# EasyEDA Pro project GritMaker.eprj

# Schematic GritMaker-circuit
Create Date: 2023-11-29; Page Name: P1; Project Name: GritMaker; Schematic Name: GritMaker-circuit; Update Date: 2023-12-03; Company: GritMaker; Drawed: Enkhbold Ganbold; Page Size: A4; Part Number: ESP32; Reviewed: Inky; Version: V0.1
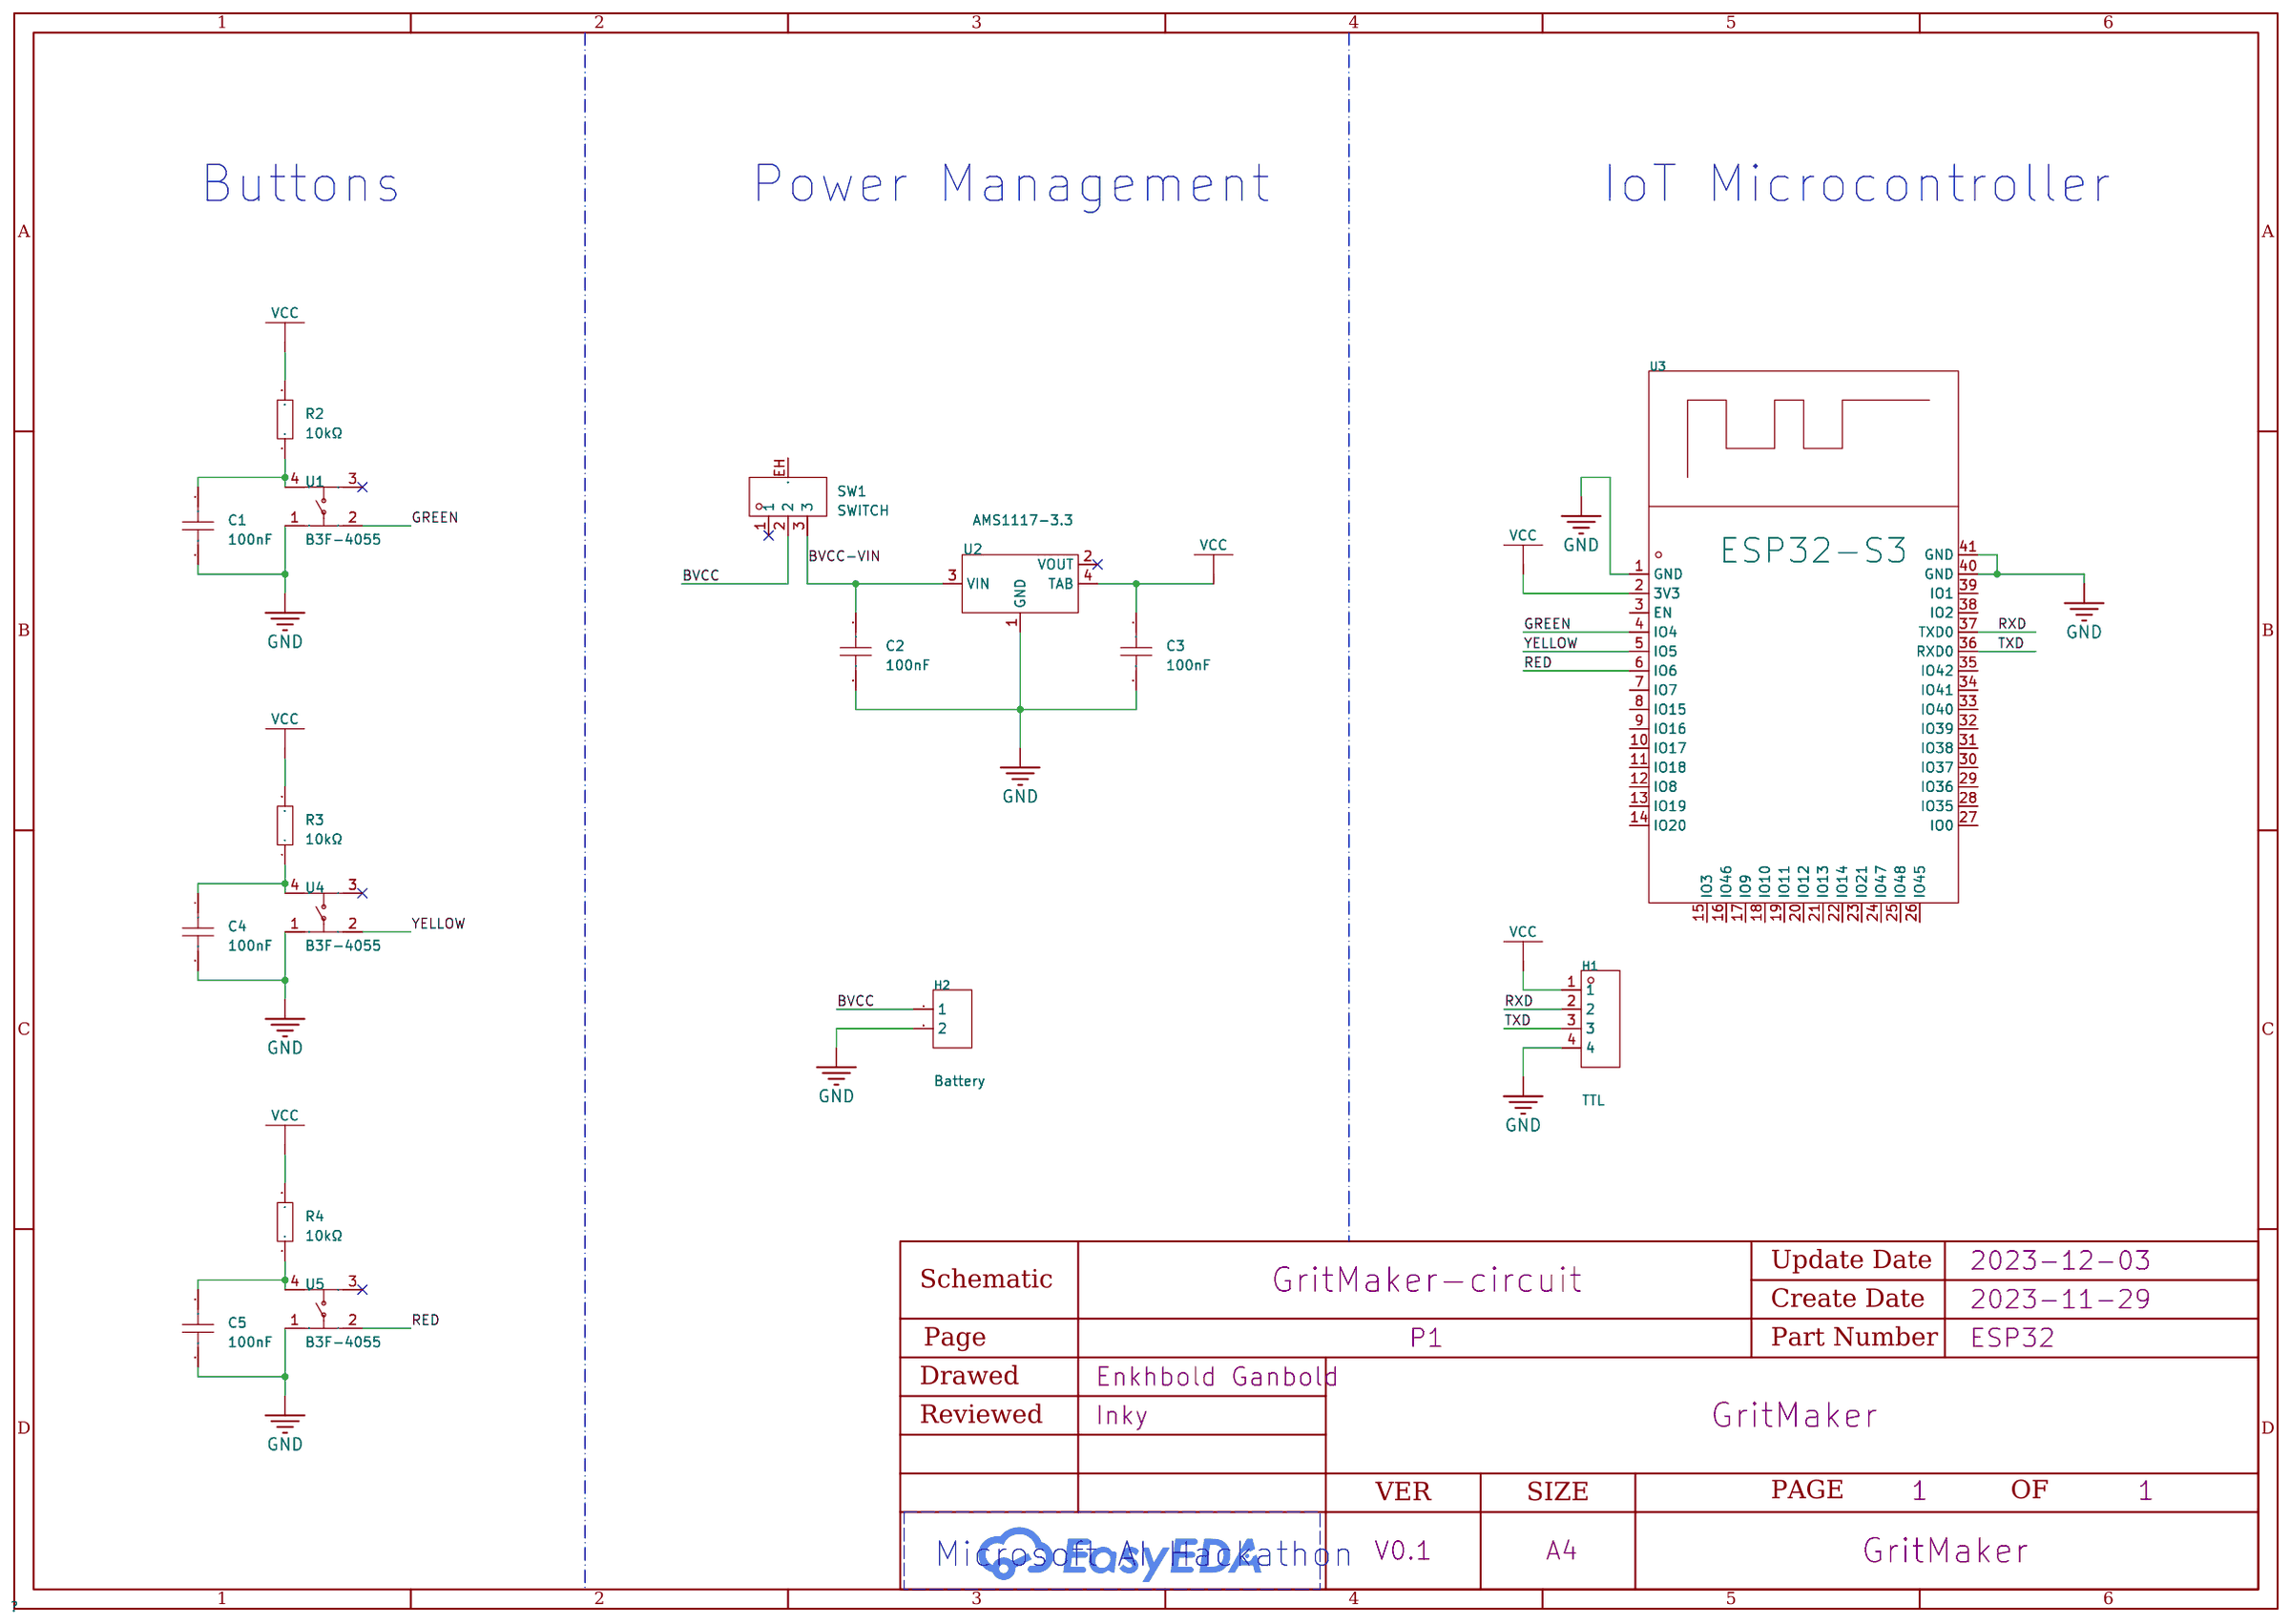
[diagram p0: schematic sheet]

## Parts
C1  100nF  [CAP-TH_L5.8-W3.6-P5.0-D0.6]
C2  100nF  [CAP-TH_L5.8-W3.6-P5.0-D0.6]
C3  100nF  [CAP-TH_L5.8-W3.6-P5.0-D0.6]
C4  100nF  [CAP-TH_L5.8-W3.6-P5.0-D0.6]
C5  100nF  [CAP-TH_L5.8-W3.6-P5.0-D0.6]
H1  TTL  [HDR-TH_4P-P2.54-V-M]
H2  Battery  [HDR-TH_2P-P2.54-V-F]
R2  10kΩ  [R_AXIAL-0.4]
R3  10kΩ  [R_AXIAL-0.4]
R4  10kΩ  [R_AXIAL-0.4]
SW1  SWITCH  [SW-TH_C9900003112]
U1  B3F-4055  [KEY-TH_4P-L12.0-W12.0-P5.00-LS13.4-EH]
U2  AMS1117-3.3  [SOT-223-3_L6.7-W3.7-P2.30-LS7.0-BR]
U3  ESP32-S3  [WIRELM-SMD_ESP32-S3-WROOM-1]
U4  B3F-4055  [KEY-TH_4P-L12.0-W12.0-P5.00-LS13.4-EH]
U5  B3F-4055  [KEY-TH_4P-L12.0-W12.0-P5.00-LS13.4-EH]

## Library data of the parts
C1-C5 = 178MU0002: Capacitance: Tolerance:±10% Tolerance:±10% Voltage Rated: Temperature Coefficient:; LCSC Part Name: 100nF ±10% 50V; Supplier Part: C5632426; Manufacturer: KNSCHA(科尼盛); Supplier Footprint: 插件,P=5.08mm; JLCPCB Part Class: Extended Part; Datasheet: https://atta.szlcsc.com/upload/public/pdf/source/20230506/08E784E6BF236BA57EBA91152AC3AC6D.pdf; Supplier: LCSC; Tolerance: ±10%
H1 = HDR-M_2.54_1x4P: Supplier Footprint: Through
H2 = HDR-F_2.54_1x2P: Supplier Footprint: Through
R2-R4 = Res_AXIAL-1/4W: Supplier Footprint: Through
SW1 = SWITCH-拨动-三脚两档: Supplier Part: C9900003112; Supplier Footprint: 插件; JLCPCB Part Class: Extended Part; Datasheet: https://atta.szlcsc.comnull; Supplier: LCSC
U1 U4 U5 = B3F-4055_C84931: Contact Current:50mA Voltage Rating (DC):24V Circuit:SPST Mounting Style:Straight Actuator Style:Square Plunger With Lamp:- Mechanical Life:- Switch Length:12mm Switch Width:12mm Switch Height:7.3mm; LCSC Part Name: 12*12*7.3mm 直插 轻触开关; Supplier Part: C84931; Manufacturer: OMRON(欧姆龙); Supplier Footprint: 插件; JLCPCB Part Class: Extended Part; Datasheet: https://atta.szlcsc.comnull; Supplier: LCSC; Contact Current: 50mA; Voltage Rating (DC): 24V; Circuit: SPST; Mounting Style: Straight; Actuator Style: Square Plunger; Switch Length: 12mm; Switch Width: 12mm; Switch Height: 7.3mm
U2 = AMS1117-3.3_C917183: Output Type:-; LCSC Part Name: 正 Vin=15V Vout=3.3V 1A; Supplier Part: C917183; Manufacturer: JSMSEMI(杰盛微); Supplier Footprint: SOT-223-3; JLCPCB Part Class: Extended Part; Datasheet: https://atta.szlcsc.com/upload/public/pdf/source/20230807/E524BD9515A5B4B5F7AFDA5AFDCDAA11.pdf; Supplier: LCSC
U3 = ESP32-S3-WROOM-1-N16: LCSC Part Name: 通用型Wi-Fi+低功耗蓝牙MCU模组; Supplier Part: C2913199; Manufacturer: ESPRESSIF(乐鑫); Supplier Footprint: SMD,18x25.5mm; JLCPCB Part Class: ExtendedPart; Datasheet: https://atta.szlcsc.com/upload/public/pdf/source/20220628/A2AC12B3C87735CAEB7EBE2DBE80936C.pdf; Supplier: LCSC

## Nets
GND: C1.2 C2.2 C3.2 C4.2 C5.2 H1.4 H2.2 U1.1 U2.1(GND) U3.1(GND) U3.40(GND) U3.41(GND) U4.1 U5.1
VCC: C3.1 H1.1 R2.2 R3.2 R4.2 U2.4(TAB) U3.2(3V3)
BVCC: H2.1 SW1.2
BVCC-VIN: C2.1 SW1.3 U2.3(VIN)
GREEN: U1.2 U3.4(IO4)
RED: U3.6(IO6) U5.2
RXD: H1.2 U3.37(TXD0)
TXD: H1.3 U3.36(RXD0)
YELLOW: U3.5(IO5) U4.2
$1N233: C1.1 R2.1 U1.4
$1N1894: C4.1 R3.1 U4.4
$1N2015: C5.1 R4.1 U5.4

Not connected (* = marked no-connect by the designer): SW1 1* EH; U1 3*; U2 2(VOUT)*; U3 3(EN) 7(IO7) 8(IO15) 9(IO16) 10(IO17) 11(IO18) 12(IO8) 13(IO19) 14(IO20) 15(IO3) 16(IO46) 17(IO9) 18(IO10) 19(IO11) 20(IO12) 21(IO13) 22(IO14) 23(IO21) 24(IO47) 25(IO48) 26(IO45) 27(IO0) 28(IO35) 29(IO36) 30(IO37) 31(IO38) 32(IO39) 33(IO40) 34(IO41) 35(IO42) 38(IO2) 39(IO1); U4 3*; U5 3*

## Notes on the sheet
- Buttons
- Power Management
- IoT Microcontroller
- Microsoft AI Hackathon

# Board GritMaker-PCB
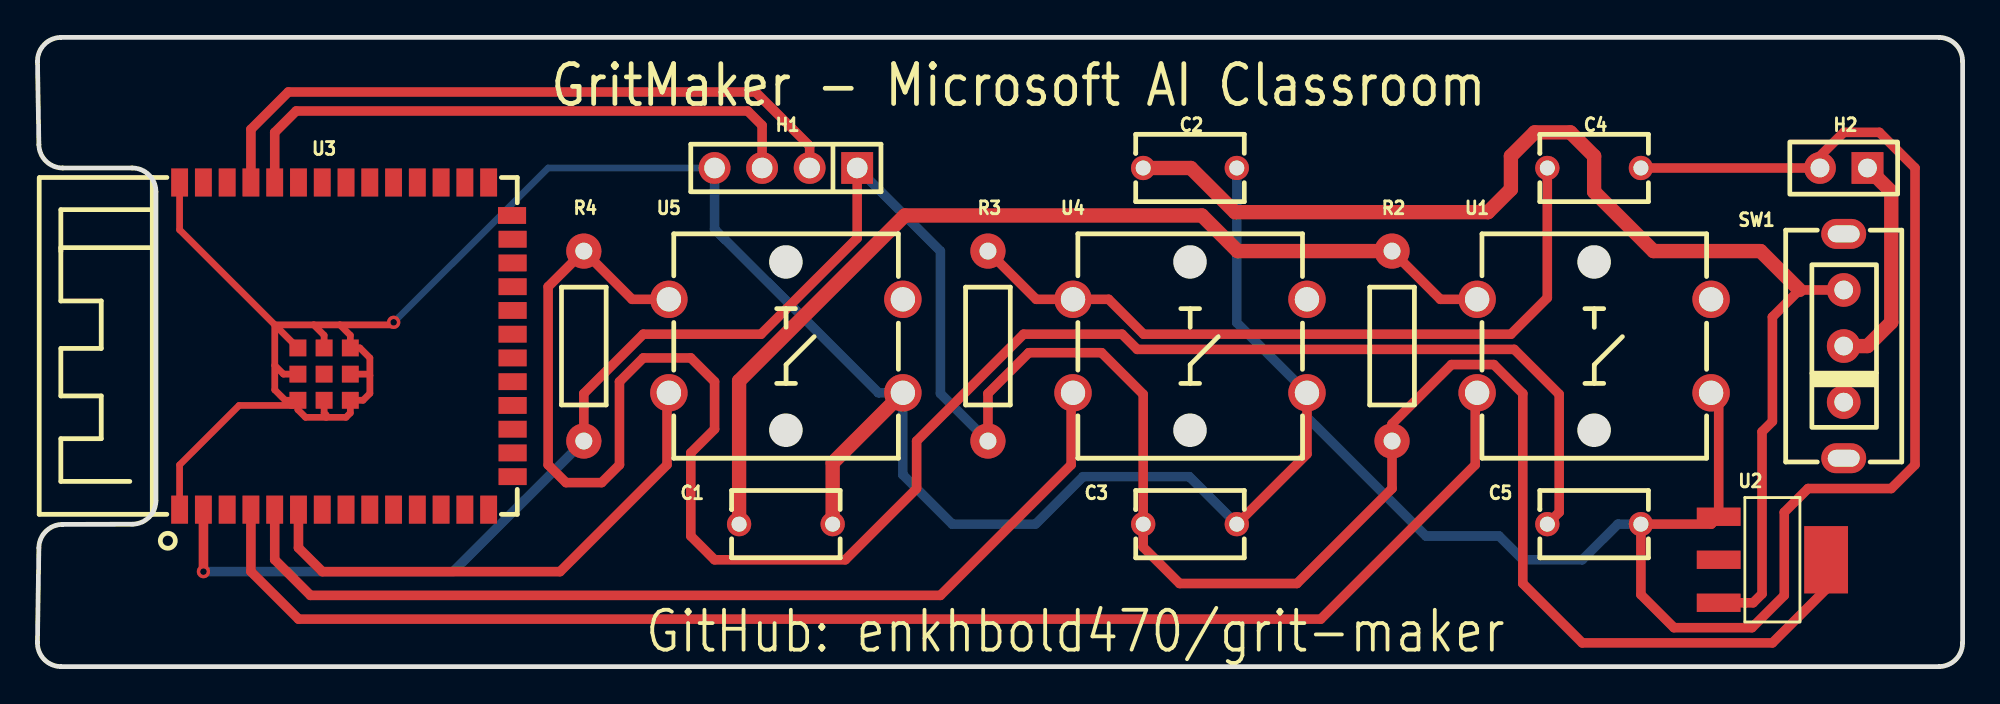
[diagram p1: board, top side]
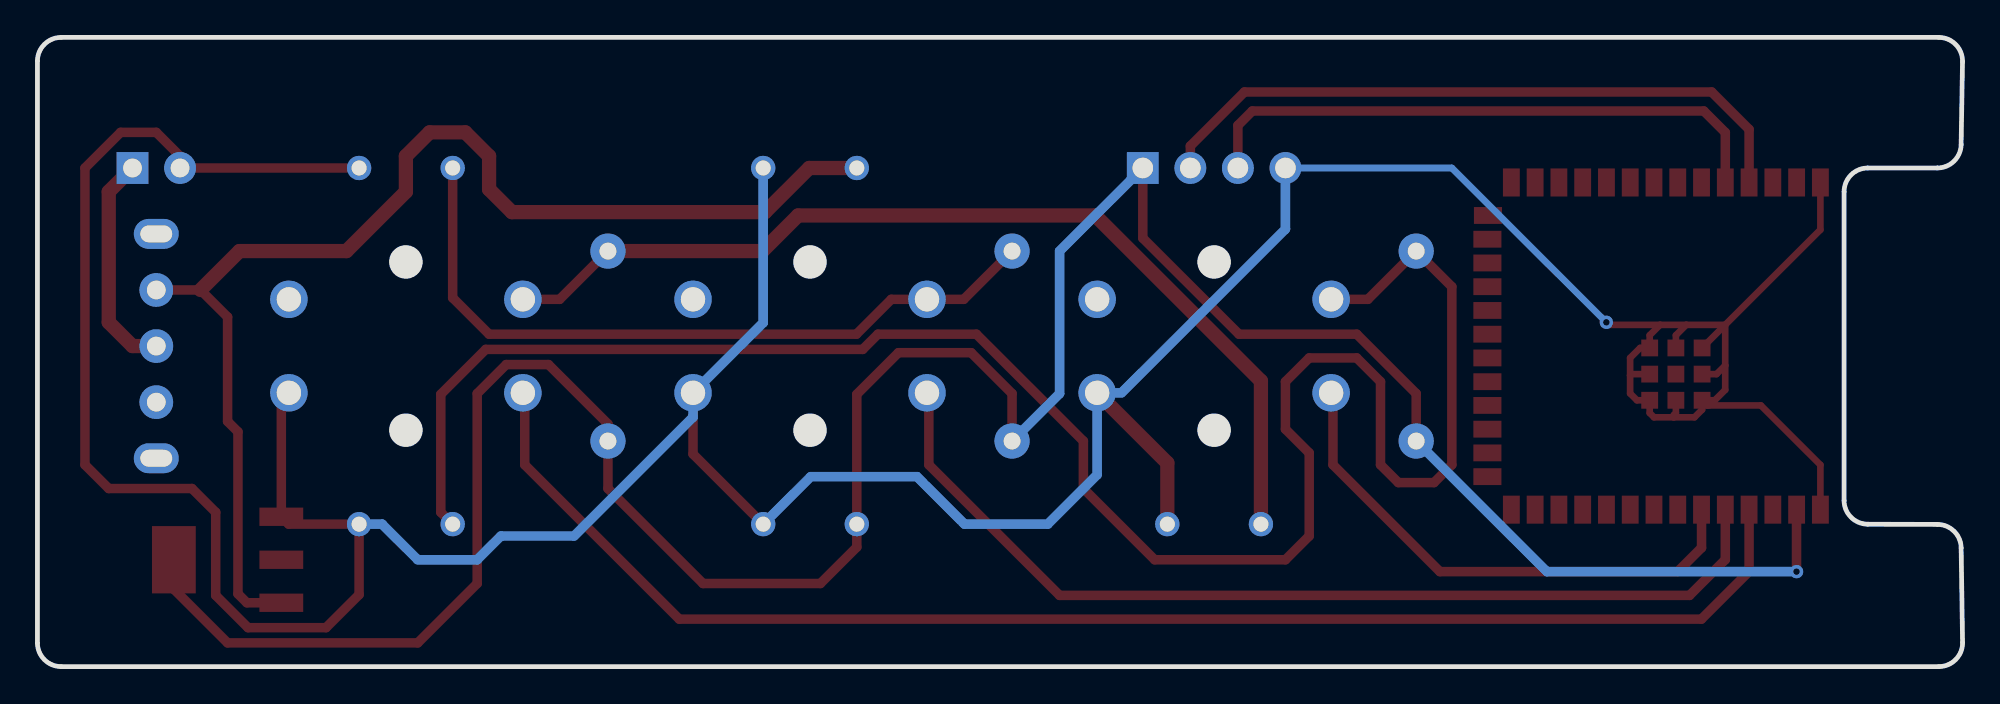
[diagram p2: board, bottom side, seen from below]

Outline 102.85 x 33.66 mm; copper layers: Top Layer, Bottom Layer. Coordinates in mm from the lower left corner of the outline.
Outline path: 0,32.36 0.08,27.92 arc(0.46,27.03) 1.35,26.67 5.06,26.67 arc(5.96,26.3) 6.33,25.4 6.33,8.89 arc(5.96,7.99) 5.06,7.62 1.34,7.61 arc(0.45,7.24) 0.08,6.36 0,1.29 arc(0.37,0.38) 1.27,0 101.58,0 arc(102.48,0.37) 102.85,1.27 102.85,32.38 arc(102.48,33.28) 101.58,33.66 1.27,33.66 arc(0.37,33.28) 0,32.36
Stack: Top Layer 0.035mm / Dielectric1 1.51mm FR4 er 4.5 / Bottom Layer 0.035mm

## Design rules (mm)
template: 8mil
spacing copperThickness1oz (default): track to track 0.305, other pairs 0.203 to 0.3
spacing copperThickness2oz: track to track 0.203, other pairs 0.152 to 0.3
track width copperThickness1oz (default): min 0.127, default 0.254, max 2.54
track width copperThickness2oz: min 0.203, default 0.254, max 2.54
differential pair differentialPair (default): width min 0.127, default 0.254, max 2.54; gap min 0.152, default 0.152
via viaSize (default): diameter min 0.5, default 0.61, max 10; hole min 0.3, default 0.305, max 6.299

## Placement (name value [footprint] x y rotation side)
C1  100nF  [CAP-TH_L5.8-W3.6-P5.0-D0.6]  39.99 7.62 0 top
C2  100nF  [CAP-TH_L5.8-W3.6-P5.0-D0.6]  61.58 26.67 0 top
C3  100nF  [CAP-TH_L5.8-W3.6-P5.0-D0.6]  61.58 7.62 0 top
C4  100nF  [CAP-TH_L5.8-W3.6-P5.0-D0.6]  83.17 26.67 0 top
C5  100nF  [CAP-TH_L5.8-W3.6-P5.0-D0.6]  83.17 7.62 0 top
H1  TTL  [HDR-TH_4P-P2.54-V-M]  39.99 26.67 180 top
H2  Battery  [HDR-TH_2P-P2.54-V-F]  96.5 26.67 180 top
R2  10kΩ  [R_AXIAL-0.4]  72.37 17.14 270 top
R3  10kΩ  [R_AXIAL-0.4]  50.78 17.14 270 top
R4  10kΩ  [R_AXIAL-0.4]  29.19 17.14 270 top
SW1  SWITCH  [SW-TH_C9900003112]  96.5 17.14 90 top
U1  B3F-4055  [KEY-TH_4P-L12.0-W12.0-P5.00-LS13.4-EH]  83.17 17.14 0 top
U2  AMS1117-3.3  [SOT-223-3_L6.7-W3.7-P2.30-LS7.0-BR]  92.69 5.71 180 top
U3  ESP32-S3  [WIRELM-SMD_ESP32-S3-WROOM-1]  16.49 17.14 90 top
U4  B3F-4055  [KEY-TH_4P-L12.0-W12.0-P5.00-LS13.4-EH]  61.58 17.14 0 top
U5  B3F-4055  [KEY-TH_4P-L12.0-W12.0-P5.00-LS13.4-EH]  39.99 17.14 0 top

## Footprints (pads in the part's own frame, mm; a bottom-side part is the same pattern mirrored in y, then rotated)
CAP-TH_L5.8-W3.6-P5.0-D0.6
  round 1.3 hole 0.8: 1(-2.5,0) 2(2.5,0)
HDR-TH_2P-P2.54-V-F
  rect 1.7x1.7 hole 1: 1(-1.27,0)
  round 1.7 hole 1: 2(1.27,0)
HDR-TH_4P-P2.54-V-M
  rect 1.7x1.7 hole 1.1: 1(-3.81,0)
  round 1.7 hole 1.1: 2(-1.27,0) 3(1.27,0) 4(3.81,0)
KEY-TH_4P-L12.0-W12.0-P5.00-LS13.4-EH
  round 2 hole 1.3: 1(6.25,-2.5) 2(-6.25,-2.5) 3(6.25,2.5) 4(-6.25,2.5)
R_AXIAL-0.4
  round 1.879 hole 0.899: 1(-5.08,0) 2(5.08,0)
SOT-223-3_L6.7-W3.7-P2.30-LS7.0-BR
  rect 2.34x0.98 smd: 1(2.87,-2.3) 2(2.87,0) 3(2.87,2.3)
  rect 2.34x3.6 smd: 4(-2.87,0)
SW-TH_C9900003112
  round 1.8 hole 1: 1(-3,0) 2(0,0) 3(3,0)
  oval 1.6x2.4 hole 0.9x1.7: EH(-6,0) EH(6,0)
WIRELM-SMD_ESP32-S3-WROOM-1
  rect 1.5x0.9 smd: 1(-8.75,8.895) 2(-8.75,7.625) 3(-8.75,6.355) 4(-8.75,5.085) 5(-8.75,3.815) 6(-8.75,2.545) 7(-8.75,1.275) 8(-8.75,0.005) 9(-8.75,-1.265) 10(-8.75,-2.535) 11(-8.75,-3.805) 12(-8.75,-5.075) 13(-8.75,-6.345) 14(-8.75,-7.615) 27(8.75,-7.615) 28(8.75,-6.345) 29(8.75,-5.075) 30(8.75,-3.805) 31(8.75,-2.535) 32(8.75,-1.265) 33(8.75,0.005) 34(8.75,1.275) 35(8.75,2.545) 36(8.75,3.815) 37(8.75,5.085) 38(8.75,6.355) 39(8.75,7.625) 40(8.75,8.895)
  rect 0.9x1.5 smd: 15(-6.985,-8.895) 16(-5.715,-8.895) 17(-4.445,-8.895) 18(-3.175,-8.895) 19(-1.905,-8.895) 20(-0.635,-8.895) 21(0.635,-8.895) 22(1.905,-8.895) 23(3.175,-8.895) 24(4.445,-8.895) 25(5.715,-8.895) 26(6.985,-8.865)
  rect 0.9x0.9 smd: 41(-2.9,2.575) 41(-2.9,1.175) 41(-2.9,-0.225) 41(-1.5,2.575) 41(-1.5,1.175) 41(-1.5,-0.225) 41(-0.1,2.575) 41(-0.1,1.175) 41(-0.1,-0.225)

## Nets
As in the schematic.

Pads without a net: SW1 1 EH; U1 3; U2 2; U3 3 7 8 9 10 11 12 13 14 15 16 17 18 19 20 21 22 23 24 25 26 27 28 29 30 31 32 33 34 35 38 39; U4 3; U5 3

## Via types
v1: diameter 0.711, hole 0.355, Top Layer to Bottom Layer, 2 vias

## Routing (per net, layer and track width the routed paths; a pad name or vN(x,y) marks a point on that pad's centre or on a via; arc(x,y) is an arc through that point)
GND: length 233.7
  Top Layer w0.355: 12.68,16.11 12.68,18.28 ; 12.68,16.11 12.68,14.8 13.24,14.24 U3.41 ; 12.68,16.11 13.14,15.64 U3.41 ; 12.68,18.28 U3.41 ; 12.68,18.28 14.76,18.28 ; 12.68,18.28 7.6,23.36 U3.40 ; 16.16,18.28 14.76,18.28 ; 16.16,18.28 18.9,18.28 v1(19.03,18.41) ; 16.16,18.28 16.72,17.72 U3.41 17.23,17.05 17.76,16.51 17.76,15.58 ; 14.76,18.28 15.32,17.72 U3.41 ; U3.41 13.92,13.74 14.32,13.33 15.43,13.33 ; U3.41 13.64,13.97 10.78,13.97 7.6,10.79 U3.1 ; U3.41 15.32,13.57 15.43,13.45 15.43,13.33 ; 17.76,15.58 17.76,14.61 17.39,14.24 U3.41 16.72,13.57 16.48,13.33 15.43,13.33 ; 17.76,15.58 17.69,15.64 U3.41
  Top Layer w0.508: U4.1 67.83,11.37 C3.2 ; U1.1 89.82,14.24 U2.1 89.43,7.62 C5.2 85.67,3.85 87.43,2.08 91.6,2.08 93.33,3.81 93.33,8.25 94.6,9.52 99.04,9.52 100.31,10.8 100.31,26.67 98.41,28.57 96.5,28.57 95.23,27.3 H2.2 C4.2
  Top Layer w0.762: U5.1 42.49,10.89 C1.2
  Bottom Layer w0.355: H1.4 27.29,26.67 v1(19.03,18.41)
  Bottom Layer w0.508: H1.4 36.18,23.4 44.93,14.64 U5.1 46.24,10.26 48.88,7.62 53.32,7.62 55.86,10.16 61.54,10.16 C3.2 ; C2.2 64.08,18.39 U4.1 67.83,13.34 74.18,6.98 78.09,6.98 79.36,5.71 82.53,5.71 84.44,7.62 C5.2
VCC: length 148.2
  Top Layer w0.508: R4.2 29.19,14.6 32.37,17.78 38.66,17.78 43.8,22.92 H1.1 ; R3.2 50.78,14.6 52.96,16.79 56.85,16.79 59.08,14.56 C3.1 59.08,6.39 61.02,4.44 67.29,4.44 72.37,9.52 R2.2 72.37,12.98 75.55,16.15 77.81,16.15 79.36,14.6 79.36,4.44 82.53,1.27 92.69,1.27 95.56,4.14 U2.4 ; v1(8.87,5.08) 8.87,8.39 U3.2
  Bottom Layer w0.508: v1(8.87,5.08) 22.21,5.08 R4.2 ; R3.2 48.24,14.6 48.24,22.22 H1.1
BVCC: length 11.8
  Top Layer w0.762: H2.1 99.04,25.4 99.04,18.41 97.77,17.14 SW1.2
BVCC-VIN: length 65.4
  Top Layer w0.508: U2.3 91.66,3.41 92.14,3.89 92.14,12.56 92.69,13.11 92.69,18.7 94.14,20.14 SW1.3
  Top Layer w0.762: C2.1 61.62,26.67 63.98,24.31 77.5,24.31 78.72,25.53 78.72,27.3 79.99,28.57 81.9,28.57 83.17,27.3 83.17,25.4 86.34,22.22 92.06,22.22 94.14,20.14
GREEN: length 77.1
  Top Layer w0.508: U3.4 11.41,5.08 13.95,2.54 68.56,2.54 76.82,10.8 76.82,14.55 U1.2
RED: length 28.5
  Top Layer w0.508: U3.6 13.95,6.35 15.22,5.08 27.92,5.08 33.64,10.8 33.64,14.55 U5.2
RXD: length 35.9
  Top Layer w0.508: U3.37 11.41,28.74 13.4,30.73 38.37,30.73 41.26,27.84 H1.2
TXD: length 31.8
  Top Layer w0.508: H1.3 38.72,28.95 37.94,29.72 13.82,29.72 12.68,28.57 U3.36
YELLOW: length 52.8
  Top Layer w0.508: U4.2 55.23,14.55 55.23,10.8 48.24,3.81 14.59,3.81 12.68,5.72 U3.5
$1N233: length 52.6
  Top Layer w0.508: U1.4 74.95,19.64 R2.1
  Top Layer w0.762: R2.1 64.12,22.22 62.21,24.13 46.34,24.13 37.49,15.28 C1.1
$1N1894: length 39.5
  Top Layer w0.508: C4.1 80.67,19.72 78.72,17.78 59.1,17.78 57.23,19.64 U4.4 53.36,19.64 R3.1
$1N2015: length 103.7
  Top Layer w0.508: C5.1 81.3,8.25 81.3,14.56 78.9,16.97 58.76,16.97 57.95,17.78 52.69,17.78 46.97,12.06 46.97,9.52 43.16,5.71 36.18,5.71 34.91,6.98 34.91,11.43 36.18,12.7 36.18,15.24 34.91,16.51 32.37,16.51 31.1,15.24 31.1,10.8 30.14,9.84 28.24,9.84 27.29,10.8 27.29,20.32 R4.1 31.77,19.64 U5.4

## Copper pours and planes (outline as drawn; the poured copper is in the pictures)
GND on Top Layer: -0.65,34.29 103.49,34.29 103.49,-0.64 -0.65,-0.64

## Text on the board
Top Silkscreen Layer: GitHub: enkhbold470/grit-maker | GritMaker - Microsoft AI Classroom
